# EAGLE schematic SmartFabric (EAGLE 7.5.0)
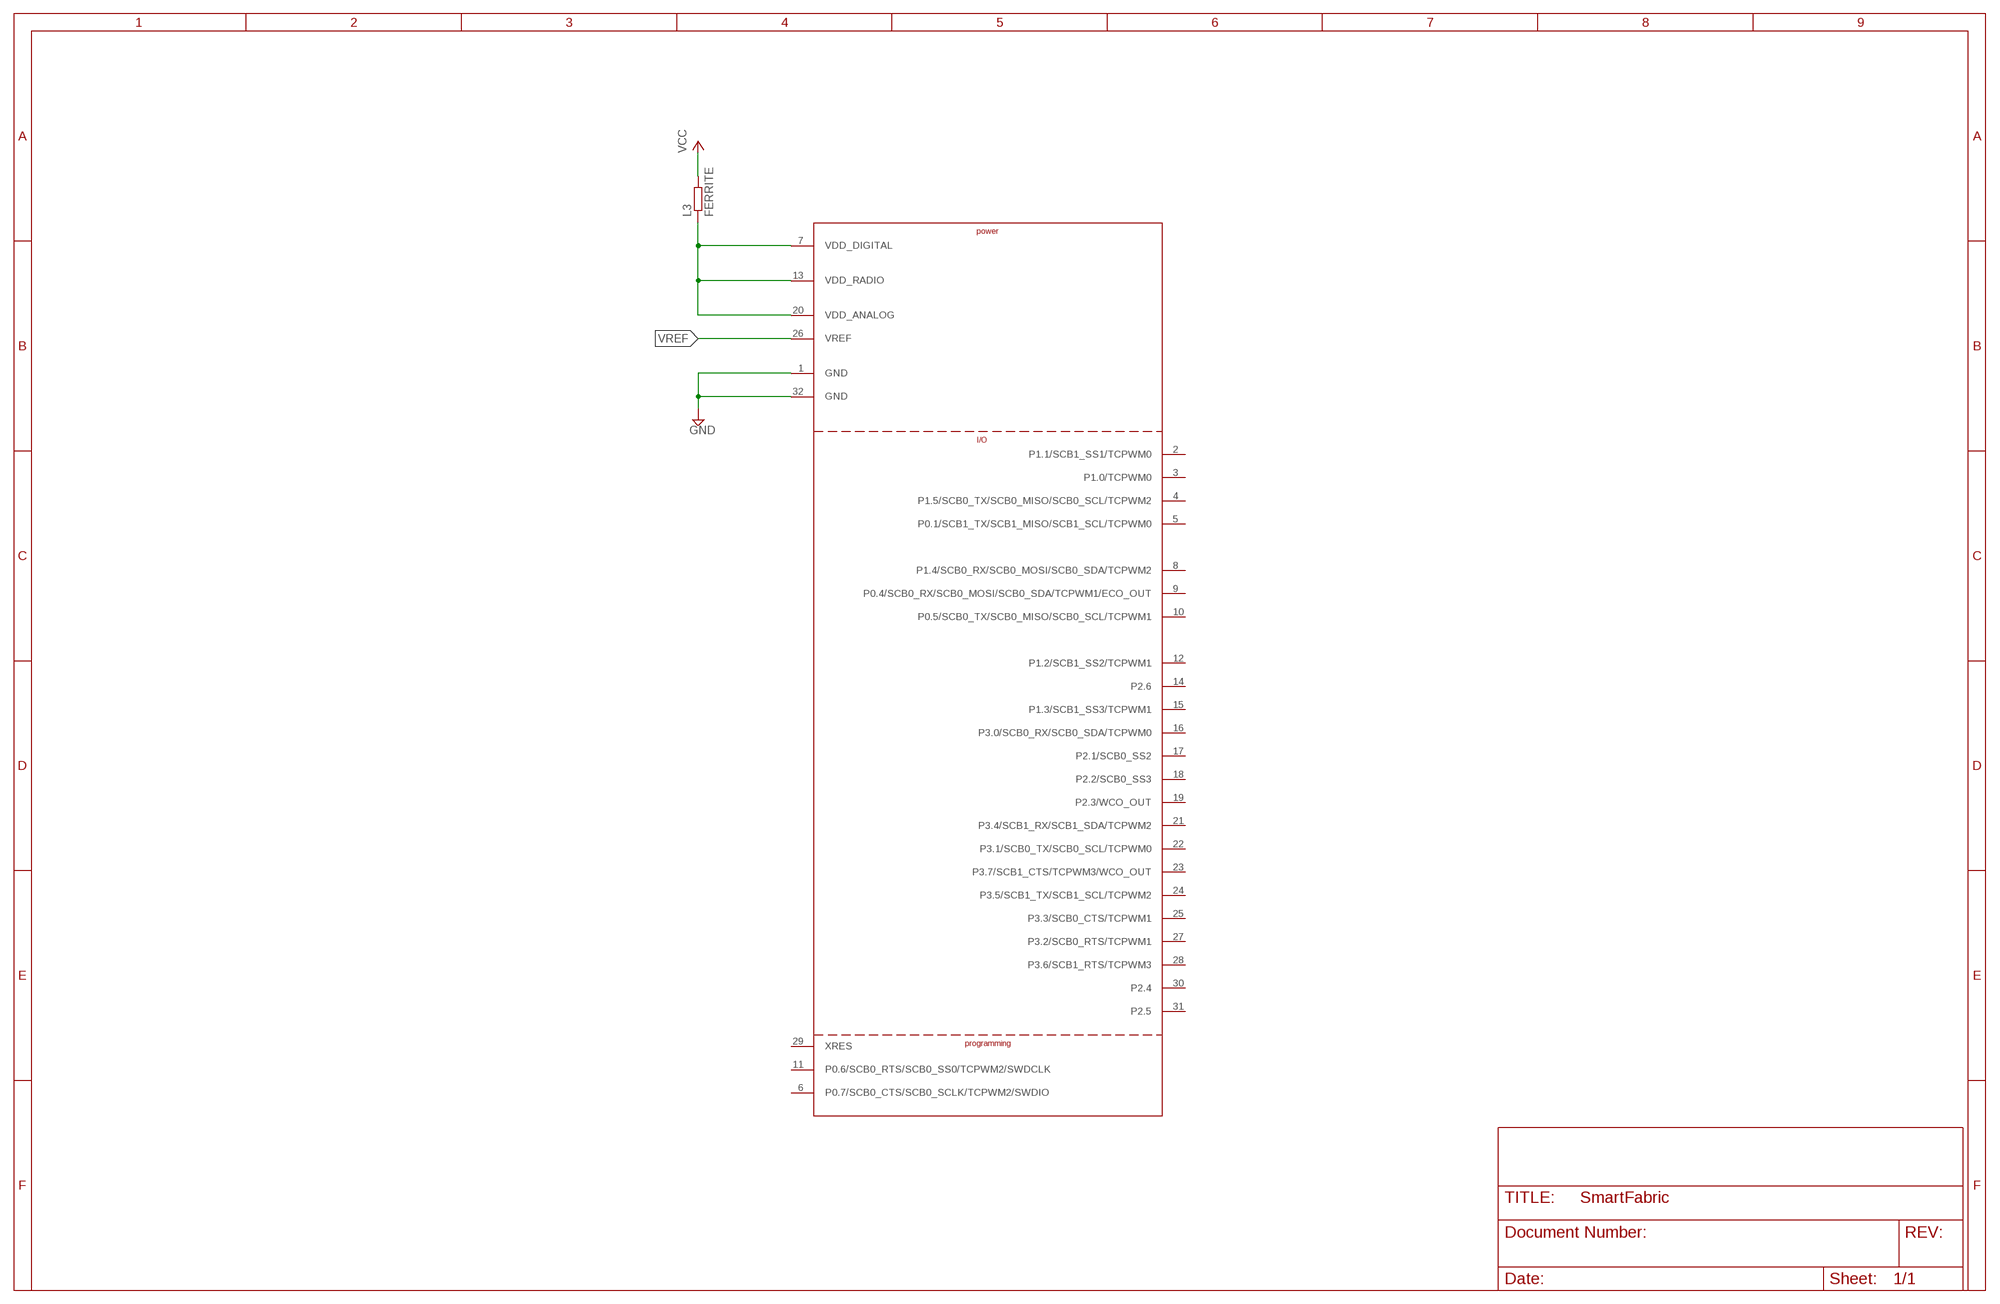
[diagram p0: schematic, sheet 1]

## Parts
L3  FERRITE  R-EU_R0805  [R0805]
U1  CYPRESS-EZ-BLE-PSOC  [CYPRESS-EZ-BLE-PROC]

## Nets
GND: U1.1(GND) U1.32(GND)
N$1: L3.1 U1.7(VDD_DIGITAL) U1.13(VDD_RADIO) U1.20(VDD_ANALOG)
VCC: L3.2
VREF: U1.26(VREF)
Unconnected: U1.2(P1.1/SCB1_SS1/TCPWM0) U1.3(P1.0/TCPWM0) U1.4(P1.5/SCB0_TX/SCB0_MISO/SCB0_SCL/TCPWM2) U1.5(P0.1/SCB1_TX/SCB1_MISO/SCB1_SCL/TCPWM0) U1.6(P0.7/SCB0_CTS/SCB0_SCLK/TCPWM2/SWDIO) U1.8(P1.4/SCB0_RX/SCB0_MOSI/SCB0_SDA/TCPWM2) U1.9(P0.4/SCB0_RX/SCB0_MOSI/SCB0_SDA/TCPWM1/ECO_OUT) U1.10(P0.5/SCB0_TX/SCB0_MISO/SCB0_SCL/TCPWM1) U1.11(P0.6/SCB0_RTS/SCB0_SS0/TCPWM2/SWDCLK) U1.12(P1.2/SCB1_SS2/TCPWM1) U1.14(P2.6) U1.15(P1.3/SCB1_SS3/TCPWM1) U1.16(P3.0/SCB0_RX/SCB0_SDA/TCPWM0) U1.17(P2.1/SCB0_SS2) U1.18(P2.2/SCB0_SS3) U1.19(P2.3/WCO_OUT) U1.21(P3.4/SCB1_RX/SCB1_SDA/TCPWM2) U1.22(P3.1/SCB0_TX/SCB0_SCL/TCPWM0) U1.23(P3.7/SCB1_CTS/TCPWM3/WCO_OUT) U1.24(P3.5/SCB1_TX/SCB1_SCL/TCPWM2) U1.25(P3.3/SCB0_CTS/TCPWM1) U1.27(P3.2/SCB0_RTS/TCPWM1) U1.28(P3.6/SCB1_RTS/TCPWM3) U1.29(XRES) U1.30(P2.4) U1.31(P2.5)

## Library data of the parts
L3 = rcl:R-EU_: RESISTOR, European symbol
U1 = wicked-device:CYPRESS-EZ-BLE-PSOC